# EAGLE schematic mainboardShield (EAGLE 6.6.0)
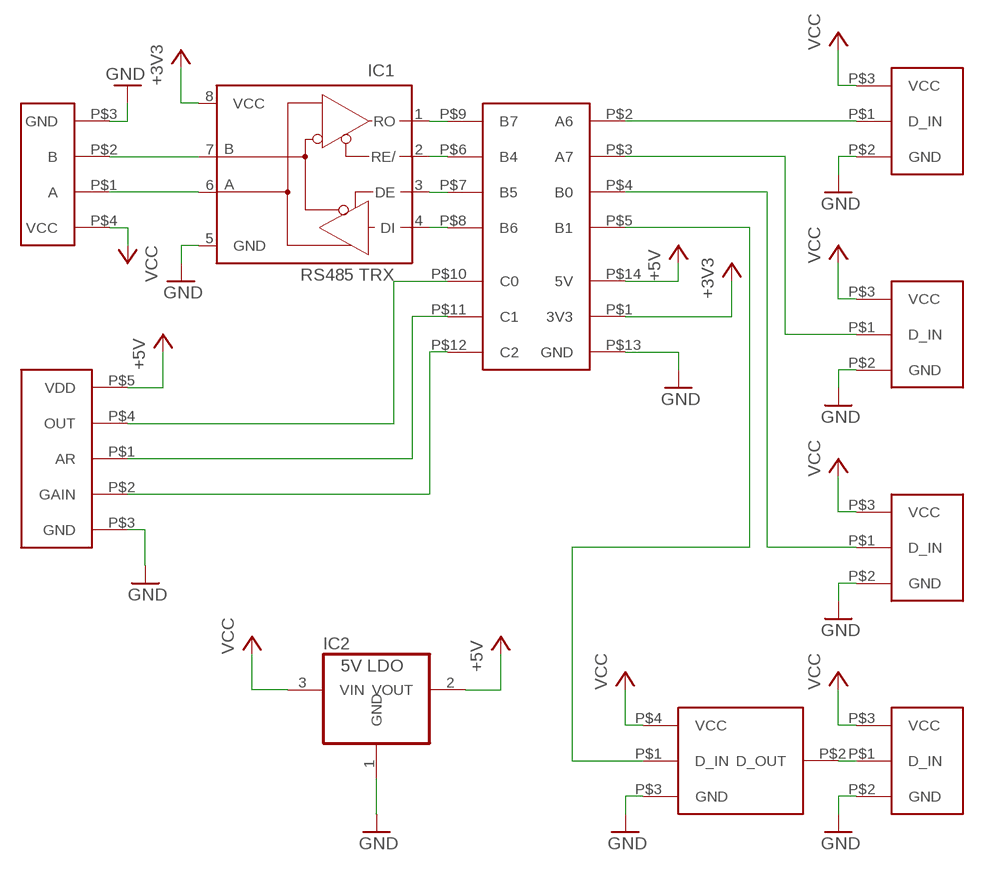
[diagram p0: schematic, sheet 1]

## Parts
IC1  RS485 TRX  MAX3469EPA  [DIL08]
IC2  5V LDO  REG1117F  [DD-3]
LEDSTRIP  LEDSTRIP  [LEDSTRIPDUMMY]
STM32  STM32F411E-DISCO  [STM32F411E-DISCO]
U$1  LEDDISPLAY  [LEDDISPLAYDUMMY]
U$2  LEDSTRIP  [LEDSTRIPDUMMY]
U$3  LEDSTRIP  [LEDSTRIPDUMMY]
U$4  LEDSTRIP  [LEDSTRIPDUMMY]
U$5  ADAFRUITMIC  [ADAFRUITMIC]
U$6  BUS  [BUS]

## Nets
+3V3: IC1.8(VCC) STM32.P$1(3V3)
+5V: IC2.2(VOUT) STM32.P$14(5V) U$5.P$5(VDD)
GND: IC1.5(GND) IC2.1(GND) LEDSTRIP.P$2(GND) STM32.P$13(GND) U$1.P$3(GND) U$2.P$2(GND) U$3.P$2(GND) U$4.P$2(GND) U$5.P$3(GND) U$6.P$3(GND)
N$1: LEDSTRIP.P$1(D_IN) STM32.P$2(A6)
N$2: U$1.P$2(D_OUT) U$3.P$1(D_IN)
N$3: STM32.P$3(A7) U$2.P$1(D_IN)
N$4: STM32.P$4(B0) U$4.P$1(D_IN)
N$5: STM32.P$5(B1) U$1.P$1(D_IN)
N$6: IC1.1(RO) STM32.P$9(B7)
N$7: IC1.2(RE/) STM32.P$6(B4)
N$8: IC1.3(DE) STM32.P$7(B5)
N$9: IC1.4(DI) STM32.P$8(B6)
N$10: IC1.7(B) U$6.P$2(B)
N$11: IC1.6(A) U$6.P$1(A)
N$12: STM32.P$12(C2) U$5.P$2(GAIN)
N$13: STM32.P$11(C1) U$5.P$1(AR)
N$14: STM32.P$10(C0) U$5.P$4(OUT)
VCC: IC2.3(VIN) LEDSTRIP.P$3(VCC) U$1.P$4(VCC) U$2.P$3(VCC) U$3.P$3(VCC) U$4.P$3(VCC) U$6.P$4(VCC)

## Library data of the parts
IC1 = maxim:MAX34*: +5V, Fail-Safe, 40Mbps, Profibus RS-485/RS-422 Transceivers Source: MAX3465-MAX3469.pdf; OC_FARNELL: unknown; OC_NEWARK: unknown
IC2 = burr-brown:REG1117: 800mA and 1A Low Dropout (LDO) Positive Regulator 1.8V, 2.5V, 2.85V, 3.3V, 5V, and Adj; MF: TEXAS INSTRUMENTS; MPN: REG1117FAKTTT; OC_FARNELL: 1296120; OC_NEWARK: 87H2562
LEDSTRIP U$2-U$4 = mbLib:LEDSTRIP
STM32 = mbLib:STM32F411E-DISCO
U$1 = mbLib:LEDDISPLAY
U$5 = mbLib:ADAFRUITMIC
U$6 = mbLib:BUS